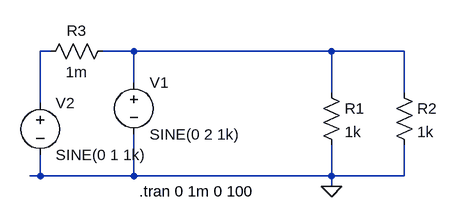
[diagram p0: schematic sine wave.asc]
sine wave.asc, the LTspice schematic file:
Version 4.1
SHEET 1 880 680
WIRE -144 96 -160 96
WIRE -16 96 -64 96
WIRE 288 96 -16 96
WIRE 400 96 288 96
WIRE -16 144 -16 96
WIRE 288 160 288 96
WIRE 400 160 400 96
WIRE -160 176 -160 96
WIRE -160 288 -160 256
WIRE -160 288 -176 288
WIRE -16 288 -16 224
WIRE -16 288 -160 288
WIRE 288 288 288 240
WIRE 288 288 -16 288
WIRE 400 288 400 240
WIRE 400 288 288 288
WIRE 288 304 288 288
FLAG 288 304 0
SYMBOL voltage -16 128 R0
WINDOW 123 0 0 Left 0
WINDOW 39 0 0 Left 0
SYMATTR InstName V1
SYMATTR Value SINE(0 2 1k)
SYMBOL res 272 144 R0
SYMATTR InstName R1
SYMATTR Value 1k
SYMBOL res 384 144 R0
SYMATTR InstName R2
SYMATTR Value 1k
SYMBOL voltage -160 160 R0
WINDOW 123 0 0 Left 0
WINDOW 39 0 0 Left 0
SYMATTR InstName V2
SYMATTR Value SINE(0 1 1k)
SYMBOL res -48 80 R90
WINDOW 0 0 56 VBottom 2
WINDOW 3 32 56 VTop 2
SYMATTR InstName R3
SYMATTR Value 1m
TEXT -8 312 Left 2 !.tran 0 1m 0 100

The netlist it stands for:
* sine wave.asc
V1 N002 0 SINE(0 2 1k)
R1 N002 0 1k
R2 N002 0 1k
V2 N001 0 SINE(0 1 1k)
R3 N002 N001 1m
.tran 0 1m 0 100
.backanno
.end